# EAGLE schematic Remote (EAGLE 7.6.0)
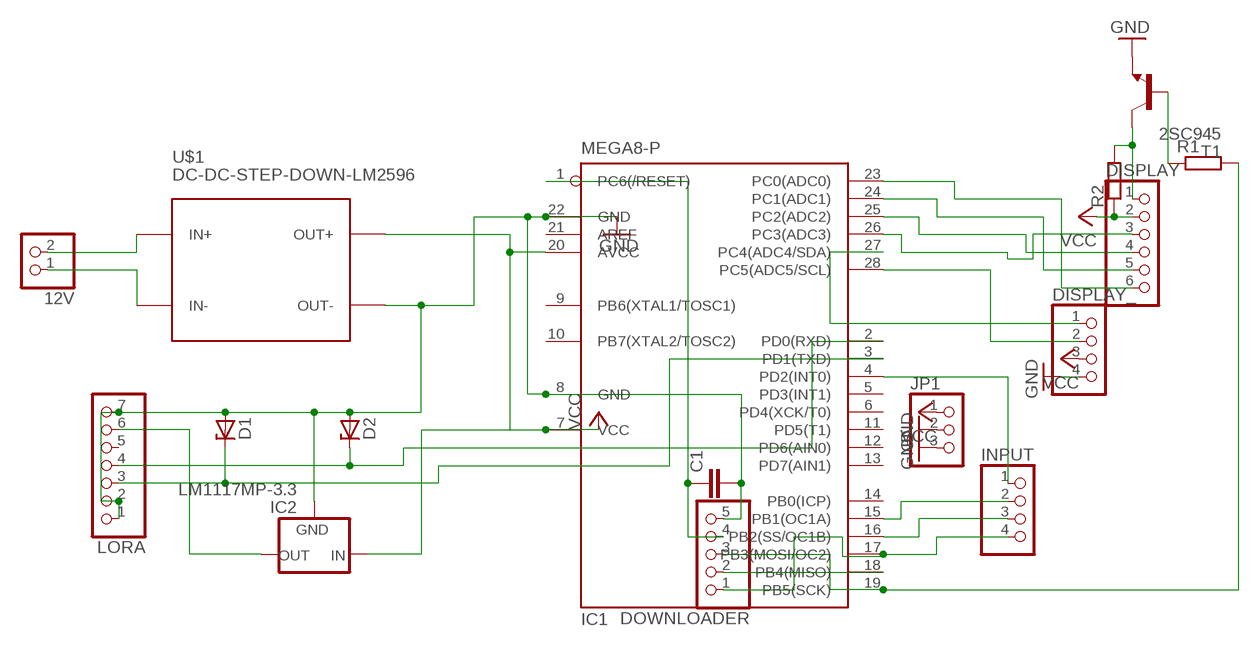
[diagram p0: schematic, sheet 1]

## Parts
12V  PINHD-1X2  [1X02]
C1  C-EU025-024X044  [C025-024X044]
D1  ZENER-DIODEDO35Z10  [DO35Z10]
D2  ZENER-DIODEDO35Z10  [DO35Z10]
DISPLAY  PINHD-1X6  [1X06]
DISPLAY_  PINHD-1X4  [1X04]
DOWNLOADER  PINHD-1X5  [1X05]
IC1  MEGA8-P  [DIL28-3]
IC2  LM1117MP-3.3  [SOT223]
INPUT  PINHD-1X4  [1X04]
JP1  PINHD-1X3  [1X03]
LORA  PINHD-1X7  [1X07]
R1  R-EU_0204/7  [0204/7]
R2  R-EU_0204/7  [0204/7]
T1  2SC945  [TO92-ECB]
U$1  DC-DC-STEP-DOWN-LM2596  [DC-DC-STEP-DOWN-LM2596]

## Nets
3.3V: IC2.2(OUT) IC2.4(OUT) LORA.6
GND: C1.2 D1.A D2.A DISPLAY_.4 DOWNLOADER.5 IC1.8(GND) IC1.22(GND) IC2.1(GND) JP1.2 JP1.3 LORA.1 LORA.2 LORA.7 T1.E U$1.OUT-
N$1: DISPLAY.6 IC1.23(PC0(ADC0))
N$2: DISPLAY.5 IC1.24(PC1(ADC1))
N$3: DISPLAY.4 IC1.25(PC2(ADC2))
N$4: DISPLAY.3 IC1.26(PC3(ADC3))
N$5: DOWNLOADER.3 IC1.19(PB5(SCK)) R1.2
N$6: DOWNLOADER.2 IC1.18(PB4(MISO))
N$7: DISPLAY_.1 IC1.27(PC4(ADC4/SDA))
N$8: DISPLAY_.2 IC1.28(PC5(ADC5/SCL))
N$9: IC1.4(PD2(INT0)) INPUT.1
N$10: IC1.15(PB1(OC1A)) INPUT.2
N$11: IC1.16(PB2(SS/OC1B)) INPUT.3
N$12: DOWNLOADER.1 IC1.17(PB3(MOSI/OC2)) INPUT.4
N$13: DISPLAY.1 R2.2 T1.C
N$14: R1.1 T1.B
N$15: C1.1 DOWNLOADER.4 IC1.1(PC6(/RESET))
N$16: 12V.2 U$1.IN+
N$17: 12V.1 U$1.IN-
RX: D1.C IC1.3(PD1(TXD)) LORA.3
TX: D2.C IC1.2(PD0(RXD)) LORA.4
VCC: DISPLAY.2 DISPLAY_.3 IC1.7(VCC) IC1.20(AVCC) IC2.3(IN) JP1.1 R2.1 U$1.OUT+
Unconnected: IC1.5(PD3(INT1)) IC1.6(PD4(XCK/T0)) IC1.9(PB6(XTAL1/TOSC1)) IC1.10(PB7(XTAL2/TOSC2)) IC1.11(PD5(T1)) IC1.12(PD6(AIN0)) IC1.13(PD7(AIN1)) IC1.14(PB0(ICP)) IC1.21(AREF) LORA.5

## Library data of the parts
12V = pinhead:PINHD-1X2: PIN HEADER
C1 = rcl:C-EU: CAPACITOR, European symbol
D1 D2 = diode:ZENER-DIODE: Z-Diode
DISPLAY = pinhead:PINHD-1X6: PIN HEADER
DISPLAY_ INPUT = pinhead:PINHD-1X4: PIN HEADER
DOWNLOADER = pinhead:PINHD-1X5: PIN HEADER
IC1 = atmel:MEGA8-P: MICROCONTROLLER 8 Kbytes FLASH, 1 kbytes SRAM, 512 bytes EEPROM, USART, 4-channel 10 bit ADC, 2-channel 8 bit ADC Pin compatible with Atmega48, ATMega88, ATMega168 Source: avr.lbr; OC_FARNELL: unknown; OC_NEWARK: unknown
IC2 = lm1117:LM1117?-*: 800mA Low-Dropout Linear Regulator Source: http://ww1.microchip.com/downloads/en/DeviceDoc/39760d.pdf; MF: Texas Instruments; MPN: LM1117MP-3.3; OC_FARNELL: 9778195; OC_NEWARK: 28X3416
JP1 = pinhead:PINHD-1X3: PIN HEADER
LORA = pinhead:PINHD-1X7: PIN HEADER
R1 R2 = rcl:R-EU_: RESISTOR, European symbol
T1 = transistor:2SC945: NPN Silicon Epitaxial Planar Transistor Source: SEMTECH ELECTRONICS LTD. ... 2SC945 2.pdf
U$1 = diy-modules:DC-DC-STEP-DOWN-LM2596: DC/DC Step-Down Regulator based on LM2596-ADJ chip LM2596 datasheet available here: http://www.ti.com/lit/ds/symlink/lm2596.pdf Click here to find device on ebay.com <http://www.ebay.com/sch/lm2596+power+regulator>